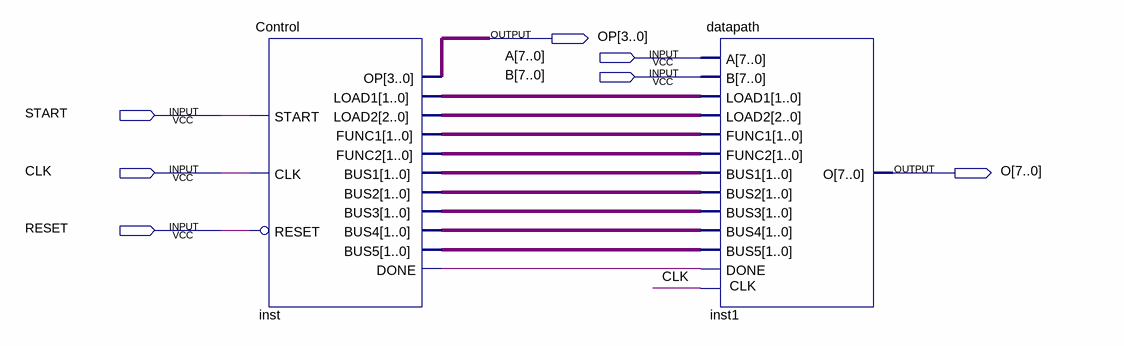
[diagram p0: schematic sheet]
// Quartus schematic pileline.bdf as structural Verilog: 2 symbols, 7 pins
module pileline (
  input  [7:0] A,
  input  [7:0] B,
  input  START,
  input  CLK,
  input  RESET,
  output [3:0] OP,
  output [7:0] O
);

  wire inst_done;
  wire [1:0] inst_bus1, inst_bus2, inst_bus3, inst_bus4, inst_bus5, inst_func1, inst_func2, inst_load1;
  wire [2:0] inst_load2;

  Control inst (
    .START(START), .CLK(CLK), .RESET(~RESET), .LOAD1(inst_load1), .LOAD2(inst_load2), .BUS1(inst_bus1),
    .BUS2(inst_bus2), .BUS3(inst_bus3), .BUS4(inst_bus4), .BUS5(inst_bus5), .FUNC1(inst_func1),
    .FUNC2(inst_func2), .DONE(inst_done), .OP(OP));
  datapath inst1 (
    .B(B), .A(A), .LOAD1(inst_load1), .CLK(CLK), .BUS1(inst_bus1), .FUNC1(inst_func1), .BUS2(inst_bus2),
    .BUS3(inst_bus3), .LOAD2(inst_load2), .BUS4(inst_bus4), .DONE(inst_done), .FUNC2(inst_func2),
    .BUS5(inst_bus5), .O(O));
endmodule
